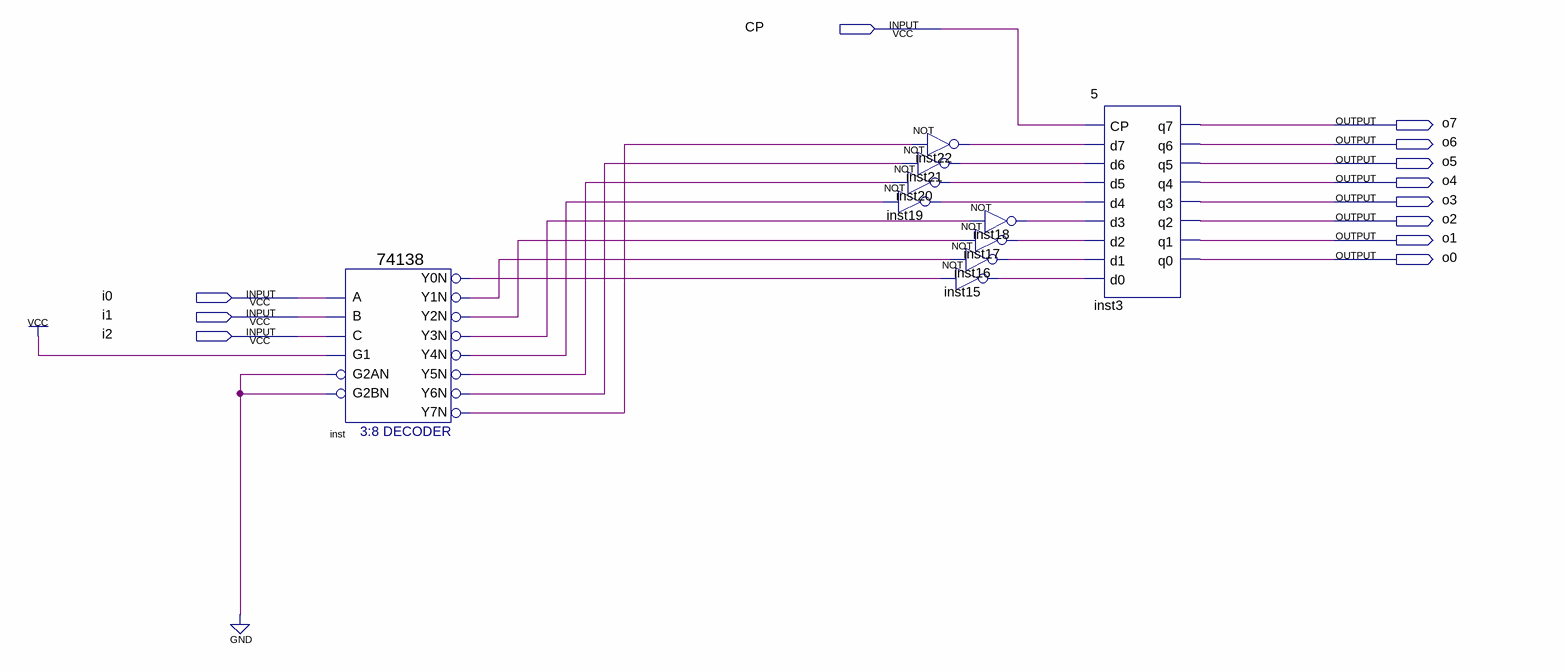
[diagram p0: schematic sheet]
// Quartus schematic 5improve.bdf as structural Verilog: 10 symbols, 12 pins
module \5improve  (
  input  CP,
  input  i0,
  input  i1,
  input  i2,
  output o7,
  output o6,
  output o5,
  output o4,
  output o3,
  output o2,
  output o1,
  output o0
);

  wire inst15_out, inst16_out, inst17_out, inst18_out, inst19_out, inst20_out, inst21_out, inst22_out,
       inst_y0n, inst_y1n, inst_y2n, inst_y3n, inst_y4n, inst_y5n, inst_y6n, inst_y7n;

  \74138  inst (
    .A(i0), .B(i1), .G1(1'b1), .C(i2), .G2AN(1'b0), .G2BN(1'b0), .Y0N(inst_y0n), .Y1N(inst_y1n),
    .Y2N(inst_y2n), .Y3N(inst_y3n), .Y4N(inst_y4n), .Y5N(inst_y5n), .Y6N(inst_y6n), .Y7N(inst_y7n));
  not inst21 (inst21_out, inst_y6n);
  not inst20 (inst20_out, inst_y5n);
  not inst19 (inst19_out, inst_y4n);
  not inst22 (inst22_out, inst_y7n);
  not inst18 (inst18_out, inst_y3n);
  not inst17 (inst17_out, inst_y2n);
  not inst16 (inst16_out, inst_y1n);
  not inst15 (inst15_out, inst_y0n);
  \5  inst3 (
    .CP(CP), .d7(inst22_out), .d6(inst21_out), .d5(inst20_out), .d4(inst19_out), .d3(inst18_out),
    .d2(inst17_out), .d1(inst16_out), .d0(inst15_out), .q7(o7), .q6(o6), .q5(o5), .q4(o4), .q3(o3), .q2(o2),
    .q1(o1), .q0(o0));
endmodule
